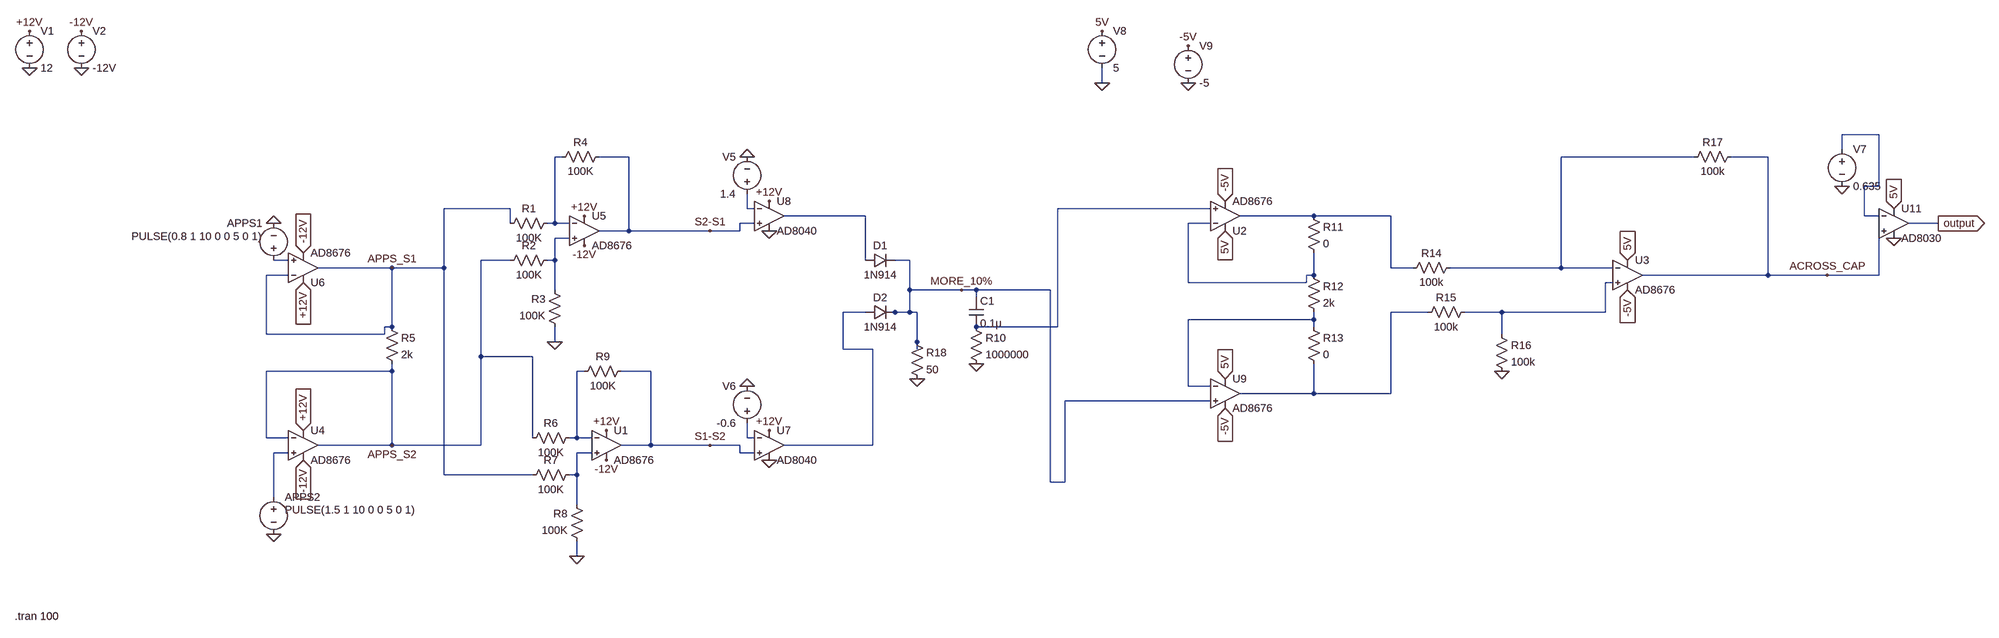
[diagram p0: schematic final final.asc]
final final.asc, the LTspice schematic file:
Version 4
SHEET 1 4616 724
WIRE 2048 -544 2048 -576
WIRE 3872 -432 3792 -432
WIRE 3792 -400 3792 -432
WIRE 880 -384 864 -384
WIRE 1024 -384 960 -384
WIRE 3472 -384 3184 -384
WIRE 3632 -384 3552 -384
WIRE 3872 -320 3872 -432
WIRE 3872 -320 3840 -320
WIRE 768 -272 624 -272
WIRE 1280 -272 1280 -304
WIRE 1296 -272 1280 -272
WIRE 2384 -272 1952 -272
WIRE 1536 -256 1360 -256
WIRE 2608 -256 2448 -256
WIRE 2816 -256 2608 -256
WIRE 3840 -256 3840 -320
WIRE 3872 -256 3840 -256
WIRE 768 -240 768 -272
WIRE 864 -240 864 -384
WIRE 864 -240 848 -240
WIRE 896 -240 864 -240
WIRE 1296 -240 1264 -240
WIRE 2384 -240 2336 -240
WIRE 4000 -240 3936 -240
WIRE 1024 -224 1024 -384
WIRE 1024 -224 960 -224
WIRE 1200 -224 1024 -224
WIRE 1264 -224 1264 -240
WIRE 1264 -224 1200 -224
WIRE 896 -208 864 -208
WIRE 3904 -208 3904 -224
WIRE 288 -160 256 -160
WIRE 768 -160 704 -160
WIRE 864 -160 864 -208
WIRE 864 -160 848 -160
WIRE 1536 -160 1536 -256
WIRE 1632 -160 1600 -160
WIRE 512 -144 352 -144
WIRE 624 -144 624 -272
WIRE 624 -144 512 -144
WIRE 2816 -144 2816 -256
WIRE 2864 -144 2816 -144
WIRE 3184 -144 3184 -384
WIRE 3184 -144 2944 -144
WIRE 3296 -144 3184 -144
WIRE 288 -128 240 -128
WIRE 2608 -128 2608 -176
WIRE 2608 -128 2592 -128
WIRE 3632 -128 3632 -384
WIRE 3632 -128 3360 -128
WIRE 3760 -128 3632 -128
WIRE 3872 -128 3872 -224
WIRE 3872 -128 3760 -128
WIRE 2336 -112 2336 -240
WIRE 2592 -112 2592 -128
WIRE 2592 -112 2336 -112
WIRE 3296 -112 3280 -112
WIRE 864 -96 864 -160
WIRE 1632 -96 1632 -160
WIRE 1744 -96 1632 -96
WIRE 1776 -96 1744 -96
WIRE 1936 -96 1776 -96
WIRE 1776 -80 1776 -96
WIRE 1536 -48 1488 -48
WIRE 1600 -48 1584 -48
WIRE 1632 -48 1632 -96
WIRE 1632 -48 1600 -48
WIRE 1648 -48 1632 -48
WIRE 2896 -48 2816 -48
WIRE 3056 -48 2976 -48
WIRE 3280 -48 3280 -112
WIRE 3280 -48 3056 -48
WIRE 2608 -32 2608 -48
WIRE 2608 -32 2336 -32
WIRE 512 -16 512 -144
WIRE 512 -16 496 -16
WIRE 1952 -16 1952 -272
WIRE 1952 -16 1776 -16
WIRE 2608 -16 2608 -32
WIRE 240 0 240 -128
WIRE 496 0 496 -16
WIRE 496 0 240 0
WIRE 3056 0 3056 -48
WIRE 864 16 864 -16
WIRE 1648 16 1648 -48
WIRE 1488 32 1488 -48
WIRE 1552 32 1488 32
WIRE 1648 32 1648 16
WIRE 704 48 704 -160
WIRE 816 48 704 48
WIRE 512 80 512 64
WIRE 512 80 240 80
WIRE 928 80 912 80
WIRE 1072 80 1008 80
WIRE 2336 112 2336 -32
WIRE 2384 112 2336 112
WIRE 2608 128 2608 64
WIRE 2608 128 2448 128
WIRE 2816 128 2816 -48
WIRE 2816 128 2608 128
WIRE 2384 144 1968 144
WIRE 240 224 240 80
WIRE 288 224 240 224
WIRE 816 224 816 48
WIRE 912 224 912 80
WIRE 912 224 896 224
WIRE 944 224 912 224
WIRE 1280 224 1280 192
WIRE 1296 224 1280 224
WIRE 512 240 512 80
WIRE 512 240 352 240
WIRE 704 240 704 48
WIRE 704 240 512 240
WIRE 1072 240 1072 80
WIRE 1072 240 1008 240
WIRE 1200 240 1072 240
WIRE 1264 240 1200 240
WIRE 1552 240 1552 32
WIRE 1552 240 1360 240
WIRE 288 256 256 256
WIRE 944 256 912 256
WIRE 1264 256 1264 240
WIRE 1296 256 1264 256
WIRE 624 304 624 -144
WIRE 816 304 624 304
WIRE 912 304 912 256
WIRE 912 304 896 304
WIRE 1936 320 1936 -96
WIRE 1968 320 1968 144
WIRE 1968 320 1936 320
WIRE 256 352 256 256
WIRE 912 368 912 304
WIRE 912 480 912 448
FLAG 864 16 0
FLAG -272 -576 0
FLAG -160 -576 0
FLAG -272 -656 +12V
FLAG -160 -656 -12V
FLAG 256 432 0
FLAG 256 -240 0
FLAG 928 -256 +12V
FLAG 320 -176 -12V
IOPIN 320 -176 In
FLAG 320 208 +12V
IOPIN 320 208 In
FLAG 320 -112 +12V
IOPIN 320 -112 In
FLAG 320 272 -12V
IOPIN 320 272 In
FLAG 928 -192 -12V
FLAG 912 480 0
FLAG 976 208 +12V
FLAG 976 272 -12V
FLAG 1280 -384 0
FLAG 1328 -288 +12V
FLAG 1280 112 0
FLAG 1328 208 +12V
FLAG 1328 -224 0
FLAG 1328 272 0
FLAG 4000 -240 output
IOPIN 4000 -240 Out
FLAG 1776 64 0
FLAG 3792 -320 0
FLAG 2048 -544 0
FLAG 2336 -544 0
FLAG 3056 80 0
FLAG 2048 -656 5V
FLAG 2336 -624 -5V
FLAG 2416 -224 5V
IOPIN 2416 -224 In
FLAG 2416 96 5V
IOPIN 2416 96 In
FLAG 3328 -96 -5V
IOPIN 3328 -96 In
FLAG 3904 -272 5V
IOPIN 3904 -272 In
FLAG 2416 -288 -5V
IOPIN 2416 -288 In
FLAG 2416 160 -5V
IOPIN 2416 160 In
FLAG 3328 -160 5V
IOPIN 3328 -160 In
FLAG 1648 96 0
FLAG 3904 -208 0
FLAG 512 -144 APPS_S1
FLAG 512 240 APPS_S2
FLAG 1200 -224 S2-S1
FLAG 1200 240 S1-S2
FLAG 1744 -96 MORE_10%
FLAG 3760 -128 ACROSS_CAP
SYMBOL res 864 -256 R90
WINDOW 0 0 56 VBottom 2
WINDOW 3 32 56 VTop 2
SYMATTR InstName R1
SYMATTR Value 100K
SYMBOL res 864 -176 R90
WINDOW 0 0 56 VBottom 2
WINDOW 3 32 56 VTop 2
SYMATTR InstName R2
SYMATTR Value 100K
SYMBOL res 880 0 R180
WINDOW 0 36 76 Left 2
WINDOW 3 36 40 Left 2
SYMATTR InstName R3
SYMATTR Value 100K
SYMBOL res 976 -400 R90
WINDOW 0 0 56 VBottom 2
WINDOW 3 32 56 VTop 2
SYMATTR InstName R4
SYMATTR Value 100K
SYMBOL voltage -272 -672 R0
WINDOW 123 0 0 Left 0
WINDOW 39 0 0 Left 0
SYMATTR InstName V1
SYMATTR Value 12
SYMBOL voltage -160 -672 R0
WINDOW 123 0 0 Left 0
WINDOW 39 0 0 Left 0
SYMATTR InstName V2
SYMATTR Value -12V
SYMBOL res 496 -32 R0
SYMATTR InstName R5
SYMATTR Value 2k
SYMBOL voltage 256 336 R0
WINDOW 123 0 0 Left 0
WINDOW 39 0 0 Left 0
WINDOW 3 24 44 Left 2
SYMATTR Value PULSE(1.5 1 10 0 0 5 0 1)
SYMATTR InstName APPS2
SYMBOL voltage 256 -144 R180
WINDOW 0 24 96 Left 2
WINDOW 3 24 68 Left 2
WINDOW 123 0 0 Left 0
WINDOW 39 0 0 Left 0
SYMATTR InstName APPS1
SYMATTR Value PULSE(0.8 1 10 0 0 5 0 1)
SYMBOL OpAmps\\AD8676 320 176 R0
SYMATTR InstName U4
SYMBOL OpAmps\\AD8676 928 -288 R0
SYMATTR InstName U5
SYMBOL OpAmps\\AD8676 320 -80 M180
SYMATTR InstName U6
SYMBOL res 912 208 R90
WINDOW 0 0 56 VBottom 2
WINDOW 3 32 56 VTop 2
SYMATTR InstName R6
SYMATTR Value 100K
SYMBOL res 912 288 R90
WINDOW 0 0 56 VBottom 2
WINDOW 3 32 56 VTop 2
SYMATTR InstName R7
SYMATTR Value 100K
SYMBOL res 928 464 R180
WINDOW 0 36 76 Left 2
WINDOW 3 36 40 Left 2
SYMATTR InstName R8
SYMATTR Value 100K
SYMBOL res 1024 64 R90
WINDOW 0 0 56 VBottom 2
WINDOW 3 32 56 VTop 2
SYMATTR InstName R9
SYMATTR Value 100K
SYMBOL OpAmps\\AD8676 976 176 R0
SYMATTR InstName U1
SYMBOL voltage 1280 -288 R180
WINDOW 0 24 96 Left 2
WINDOW 3 24 16 Left 2
WINDOW 123 0 0 Left 0
WINDOW 39 0 0 Left 0
SYMATTR InstName V5
SYMATTR Value 1.4
SYMBOL voltage 1280 208 R180
WINDOW 0 24 96 Left 2
WINDOW 3 24 16 Left 2
WINDOW 123 0 0 Left 0
WINDOW 39 0 0 Left 0
SYMATTR InstName V6
SYMATTR Value -0.6
SYMBOL OpAmps\\AD8040 1328 176 R0
SYMATTR InstName U7
SYMBOL OpAmps\\AD8040 1328 -320 R0
SYMATTR InstName U8
SYMBOL cap 1760 -80 R0
SYMATTR InstName C1
SYMATTR Value 0.1µ
SYMBOL res 1760 -32 R0
SYMATTR InstName R10
SYMATTR Value 1000000
SYMBOL voltage 3792 -416 R0
WINDOW 123 0 0 Left 0
WINDOW 39 0 0 Left 0
SYMATTR InstName V7
SYMATTR Value 0.635
SYMBOL voltage 2048 -672 R0
WINDOW 123 0 0 Left 0
WINDOW 39 0 0 Left 0
SYMATTR InstName V8
SYMATTR Value 5
SYMBOL voltage 2336 -640 R0
WINDOW 123 0 0 Left 0
WINDOW 39 0 0 Left 0
SYMATTR InstName V9
SYMATTR Value -5
SYMBOL res 2592 -272 R0
SYMATTR InstName R11
SYMATTR Value 0
SYMBOL res 2592 -144 R0
SYMATTR InstName R12
SYMATTR Value 2k
SYMBOL res 2592 -32 R0
SYMATTR InstName R13
SYMATTR Value 0
SYMBOL res 2960 -160 R90
WINDOW 0 0 56 VBottom 2
WINDOW 3 32 56 VTop 2
SYMATTR InstName R14
SYMATTR Value 100k
SYMBOL res 2992 -64 R90
WINDOW 0 0 56 VBottom 2
WINDOW 3 32 56 VTop 2
SYMATTR InstName R15
SYMATTR Value 100k
SYMBOL res 3040 -16 R0
SYMATTR InstName R16
SYMATTR Value 100k
SYMBOL res 3568 -400 R90
WINDOW 0 0 56 VBottom 2
WINDOW 3 32 56 VTop 2
SYMATTR InstName R17
SYMATTR Value 100k
SYMBOL OpAmps\\AD8676 2416 -192 M180
SYMATTR InstName U2
SYMBOL OpAmps\\AD8676 3328 -192 R0
SYMATTR InstName U3
SYMBOL OpAmps\\AD8676 2416 64 R0
SYMATTR InstName U9
SYMBOL diode 1536 -176 M90
WINDOW 0 0 32 VBottom 2
WINDOW 3 32 32 VTop 2
SYMATTR InstName D1
SYMATTR Value 1N914
SYMBOL diode 1536 -64 M90
WINDOW 0 0 32 VBottom 2
WINDOW 3 32 32 VTop 2
SYMATTR InstName D2
SYMATTR Value 1N914
SYMBOL res 1632 0 R0
SYMATTR InstName R18
SYMATTR Value 50
SYMBOL OpAmps\\AD8030 3904 -304 R0
SYMATTR InstName U11
TEXT -304 616 Left 2 !.tran 100

The netlist it stands for:
* final final.asc
R1 N002 APPS_S1 100K
R2 N009 APPS_S2 100K
R3 0 N009 100K
R4 S2-S1 N002 100K
V1 +12V 0 12
V2 -12V 0 -12V
R5 APPS_S1 APPS_S2 2k
V§APPS2 N017 0 PULSE(1.5 1 10 0 0 5 0 1)
V§APPS1 N010 0 PULSE(0.8 1 10 0 0 5 0 1)
XU4 N017 APPS_S2 +12V -12V APPS_S2 AD8676  ; pins In+ In- V+ V- OUT
XU5 N009 N002 +12V -12V S2-S1 AD8676  ; pins In+ In- V+ V- OUT
XU6 N010 APPS_S1 +12V -12V APPS_S1 AD8676  ; pins In+ In- V+ V- OUT
R6 N015 APPS_S2 100K
R7 N018 APPS_S1 100K
R8 0 N018 100K
R9 S1-S2 N015 100K
XU1 N018 N015 +12V -12V S1-S2 AD8676  ; pins In+ In- V+ V- OUT
V5 N004 0 1.4
V6 N016 0 -0.6
XU7 S1-S2 N016 +12V 0 N012 AD8040  ; pins In+ In- V+ V- OUT
XU8 S2-S1 N004 +12V 0 N006 AD8040  ; pins In+ In- V+ V- OUT
C1 MORE_10% N005 0.1µ
R10 N005 0 1000000
V7 N001 0 0.635
V8 5V 0 5
V9 -5V 0 -5
R11 N007 N008 0
R12 N008 N014 2k
R13 N014 N013 0
R14 N003 N007 100k
R15 N011 N013 100k
R16 N011 0 100k
R17 ACROSS_CAP N003 100k
XU2 N005 N008 5V -5V N007 AD8676  ; pins In+ In- V+ V- OUT
XU3 N011 N003 5V -5V ACROSS_CAP AD8676  ; pins In+ In- V+ V- OUT
XU9 MORE_10% N014 5V -5V N013 AD8676  ; pins In+ In- V+ V- OUT
D1 N006 MORE_10% 1N914
D2 N012 MORE_10% 1N914
R18 MORE_10% 0 50
XU11 ACROSS_CAP N001 5V 0 output AD8040  ; AD8030, pins In+ In- V+ V- OUT
.model D D
.lib standard.dio
.tran 100
.lib ADI.lib
.backanno
.end